# EAGLE schematic display (EAGLE 9.5.2)
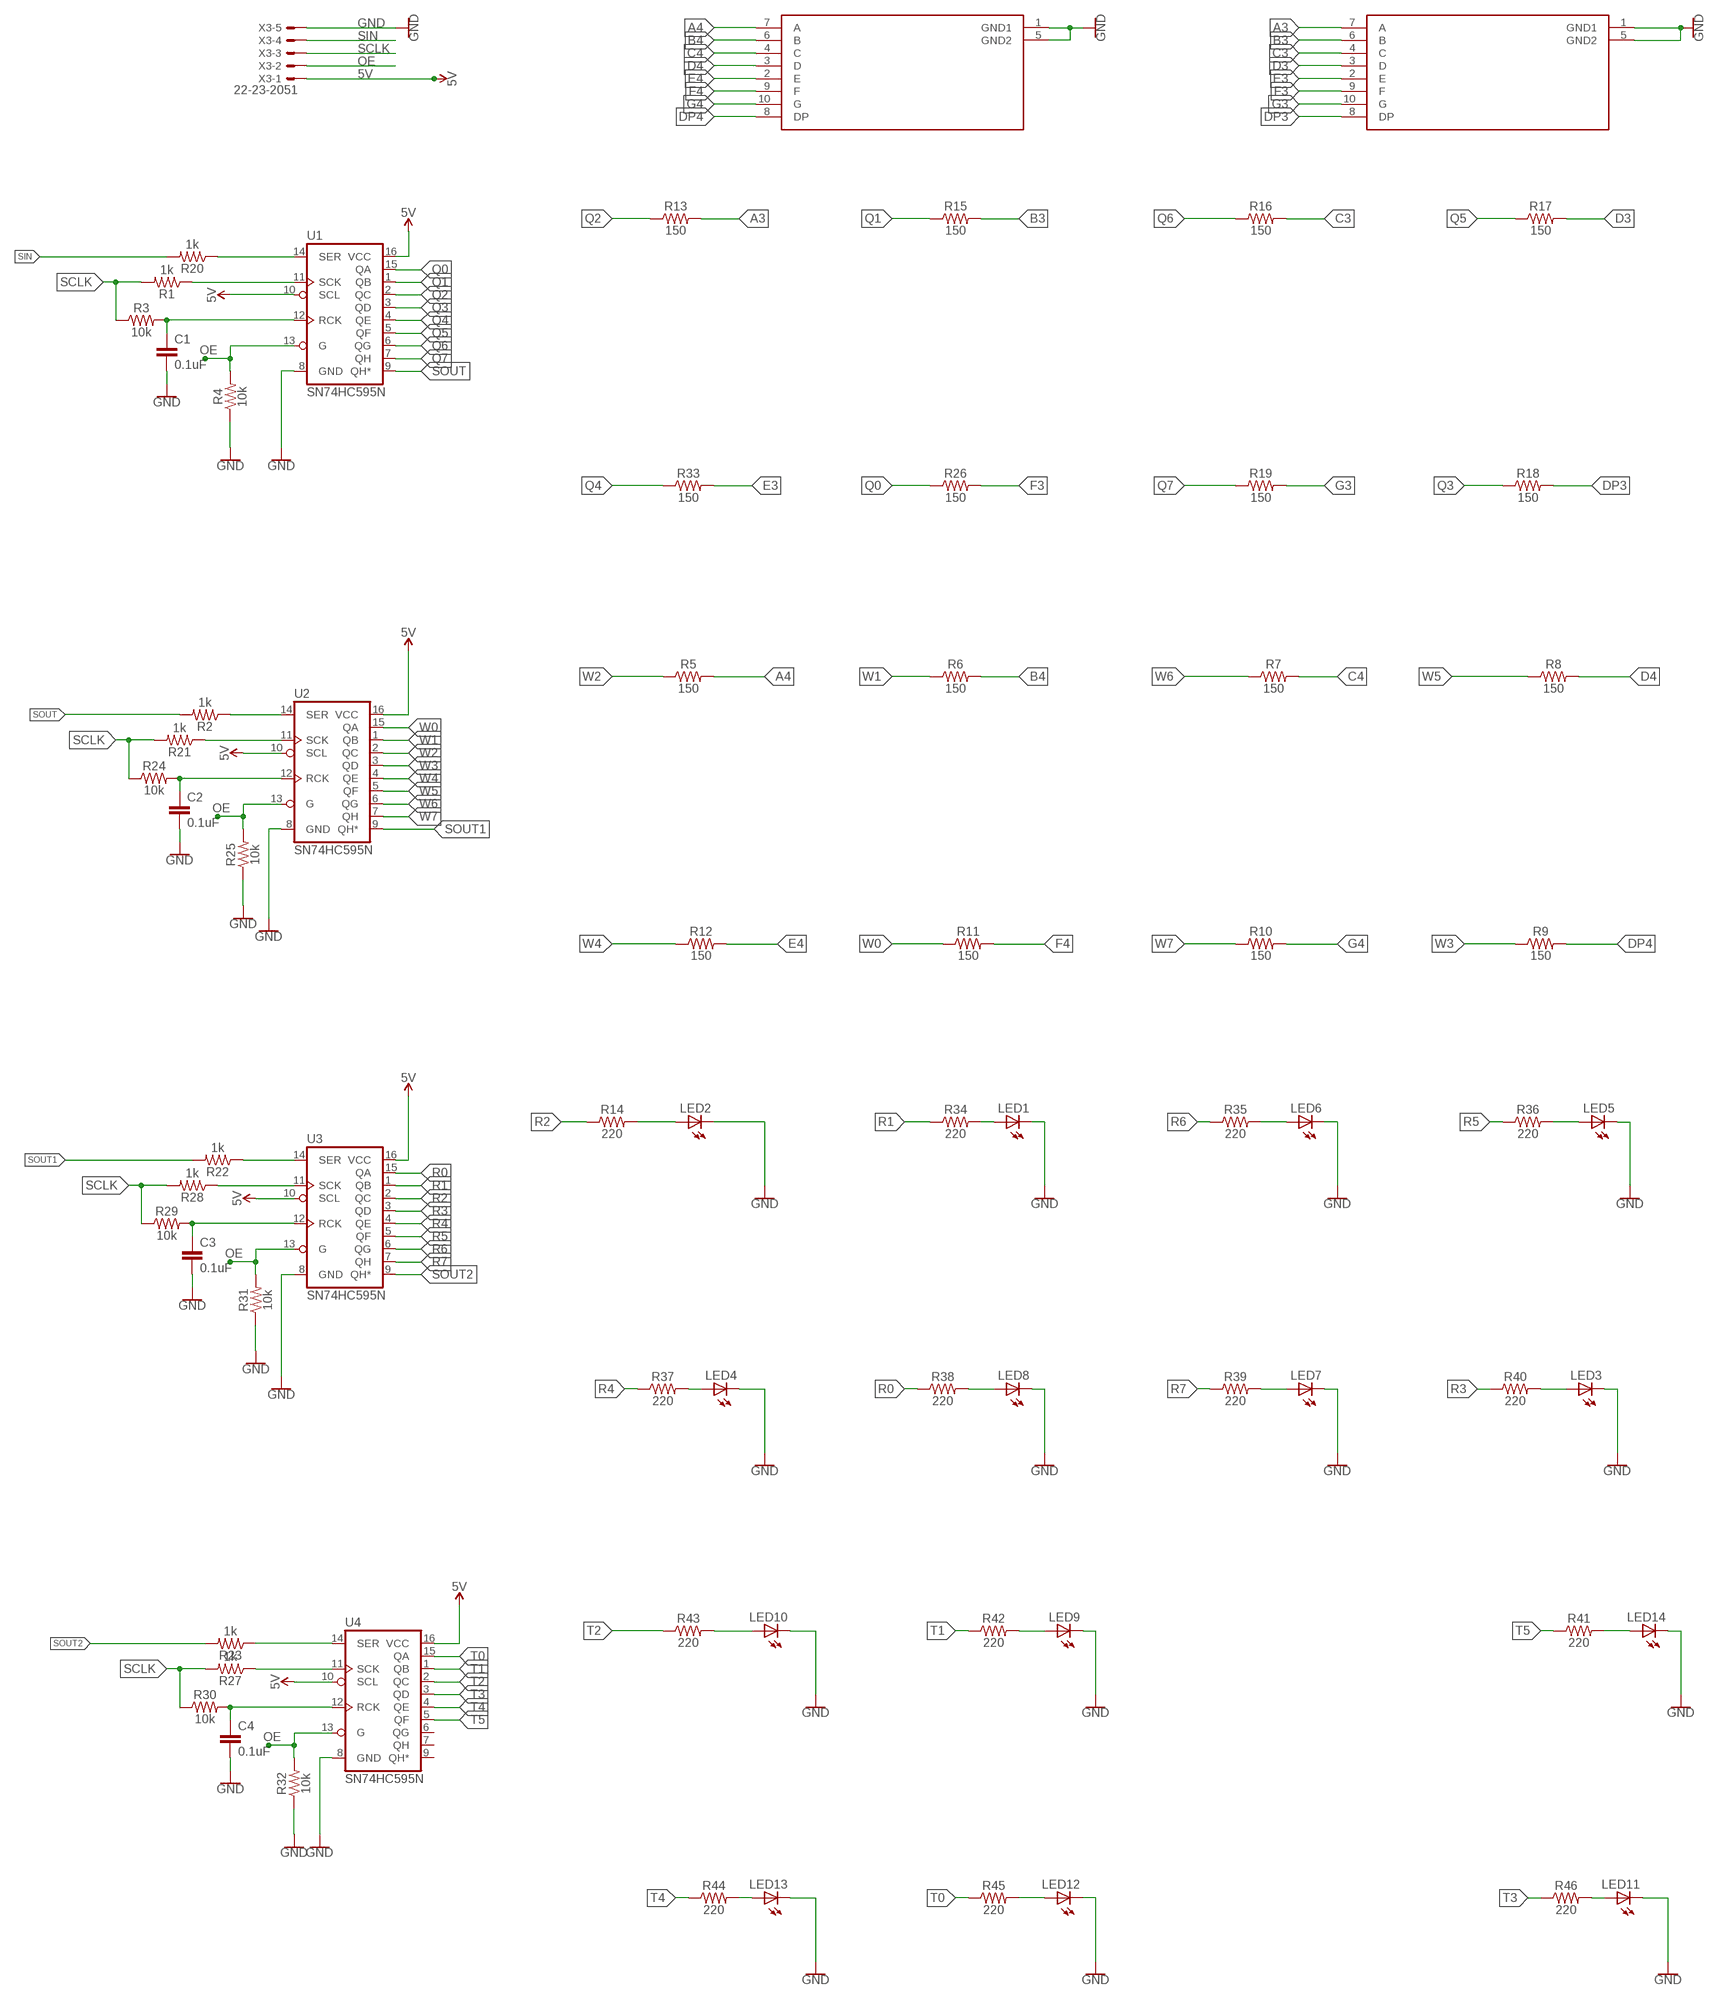
[diagram p0: schematic, sheet 1]

## Parts
C1  0.1uF  22PF-PTH-2.54MM-200V-5%  [CAP-PTH-2.54]
C2  0.1uF  22PF-PTH-2.54MM-200V-5%  [CAP-PTH-2.54]
C3  0.1uF  22PF-PTH-2.54MM-200V-5%  [CAP-PTH-2.54]
C4  0.1uF  22PF-PTH-2.54MM-200V-5%  [CAP-PTH-2.54]
LED1  LED5MM  [LED5MM]
LED2  LED5MM  [LED5MM]
LED3  LED5MM  [LED5MM]
LED4  LED5MM  [LED5MM]
LED5  LED5MM  [LED5MM]
LED6  LED5MM  [LED5MM]
LED7  LED5MM  [LED5MM]
LED8  LED5MM  [LED5MM]
LED9  LED5MM  [LED5MM]
LED10  LED5MM  [LED5MM]
LED11  LED5MM  [LED5MM]
LED12  LED5MM  [LED5MM]
LED13  LED5MM  [LED5MM]
LED14  LED5MM  [LED5MM]
R1  1k  1KOHM-HORIZ-1/4W-5%  [AXIAL-0.3]
R2  1k  1KOHM-HORIZ-1/4W-5%  [AXIAL-0.3]
R3  10k  10KOHM-HORIZ-1/4W-5%  [AXIAL-0.3]
R4  10k  10KOHM-HORIZ-1/4W-5%  [AXIAL-0.3]
R5  150  10KOHM-HORIZ-1/4W-5%  [AXIAL-0.3]
R6  150  10KOHM-HORIZ-1/4W-5%  [AXIAL-0.3]
R7  150  10KOHM-HORIZ-1/4W-5%  [AXIAL-0.3]
R8  150  10KOHM-HORIZ-1/4W-5%  [AXIAL-0.3]
R9  150  10KOHM-HORIZ-1/4W-5%  [AXIAL-0.3]
R10  150  10KOHM-HORIZ-1/4W-5%  [AXIAL-0.3]
R11  150  10KOHM-HORIZ-1/4W-5%  [AXIAL-0.3]
R12  150  10KOHM-HORIZ-1/4W-5%  [AXIAL-0.3]
R13  150  10KOHM-HORIZ-1/4W-5%  [AXIAL-0.3]
R14  220  10KOHM-HORIZ-1/4W-5%  [AXIAL-0.3]
R15  150  10KOHM-HORIZ-1/4W-5%  [AXIAL-0.3]
R16  150  10KOHM-HORIZ-1/4W-5%  [AXIAL-0.3]
R17  150  10KOHM-HORIZ-1/4W-5%  [AXIAL-0.3]
R18  150  10KOHM-HORIZ-1/4W-5%  [AXIAL-0.3]
R19  150  10KOHM-HORIZ-1/4W-5%  [AXIAL-0.3]
R20  1k  1KOHM-HORIZ-1/4W-5%  [AXIAL-0.3]
R21  1k  1KOHM-HORIZ-1/4W-5%  [AXIAL-0.3]
R22  1k  1KOHM-HORIZ-1/4W-5%  [AXIAL-0.3]
R23  1k  1KOHM-HORIZ-1/4W-5%  [AXIAL-0.3]
R24  10k  10KOHM-HORIZ-1/4W-5%  [AXIAL-0.3]
R25  10k  10KOHM-HORIZ-1/4W-5%  [AXIAL-0.3]
R26  150  10KOHM-HORIZ-1/4W-5%  [AXIAL-0.3]
R27  1k  1KOHM-HORIZ-1/4W-5%  [AXIAL-0.3]
R28  1k  1KOHM-HORIZ-1/4W-5%  [AXIAL-0.3]
R29  10k  10KOHM-HORIZ-1/4W-5%  [AXIAL-0.3]
R30  10k  10KOHM-HORIZ-1/4W-5%  [AXIAL-0.3]
R31  10k  10KOHM-HORIZ-1/4W-5%  [AXIAL-0.3]
R32  10k  10KOHM-HORIZ-1/4W-5%  [AXIAL-0.3]
R33  150  10KOHM-HORIZ-1/4W-5%  [AXIAL-0.3]
R34  220  10KOHM-HORIZ-1/4W-5%  [AXIAL-0.3]
R35  220  10KOHM-HORIZ-1/4W-5%  [AXIAL-0.3]
R36  220  10KOHM-HORIZ-1/4W-5%  [AXIAL-0.3]
R37  220  10KOHM-HORIZ-1/4W-5%  [AXIAL-0.3]
R38  220  10KOHM-HORIZ-1/4W-5%  [AXIAL-0.3]
R39  220  10KOHM-HORIZ-1/4W-5%  [AXIAL-0.3]
R40  220  10KOHM-HORIZ-1/4W-5%  [AXIAL-0.3]
R41  220  10KOHM-HORIZ-1/4W-5%  [AXIAL-0.3]
R42  220  10KOHM-HORIZ-1/4W-5%  [AXIAL-0.3]
R43  220  10KOHM-HORIZ-1/4W-5%  [AXIAL-0.3]
R44  220  10KOHM-HORIZ-1/4W-5%  [AXIAL-0.3]
R45  220  10KOHM-HORIZ-1/4W-5%  [AXIAL-0.3]
R46  220  10KOHM-HORIZ-1/4W-5%  [AXIAL-0.3]
U1  SN74HC595N  74HC595N  [DIP16]
U2  SN74HC595N  74HC595N  [DIP16]
U3  SN74HC595N  74HC595N  [DIP16]
U4  SN74HC595N  74HC595N  [DIP16]
U$1  DISPLAY1.2  [1.2INCH]
U$2  DISPLAY1.2  [1.2INCH]
X3  22-23-2051  [22-23-2051]

## Nets
5V [5v]: U1.10(SCL) U1.16(VCC) U2.10(SCL) U2.16(VCC) U3.10(SCL) U3.16(VCC) U4.10(SCL) U4.16(VCC) X3.1
A3: R13.P$2 U$1.7(A)
A4: R5.P$2 U$2.7(A)
B3: R15.P$2 U$1.6(B)
B4: R6.P$2 U$2.6(B)
C3: R16.P$2 U$1.4(C)
C4: R7.P$2 U$2.4(C)
D3: R17.P$2 U$1.3(D)
D4: R8.P$2 U$2.3(D)
DP3: R18.P$2 U$1.8(DP)
DP4: R9.P$2 U$2.8(DP)
E3: R33.P$2 U$1.2(E)
E4: R12.P$2 U$2.2(E)
F3: R26.P$2 U$1.9(F)
F4: R11.P$2 U$2.9(F)
G3: R19.P$2 U$1.10(G)
G4: R10.P$2 U$2.10(G)
GND: C1.2 C2.2 C3.2 C4.2 LED1.K(C) LED2.K(C) LED3.K(C) LED4.K(C) LED5.K(C) LED6.K(C) LED7.K(C) LED8.K(C) LED9.K(C) LED10.K(C) LED11.K(C) LED12.K(C) LED13.K(C) LED14.K(C) R4.P$1 R25.P$1 R31.P$1 R32.P$1 U1.8(GND) U2.8(GND) U3.8(GND) U4.8(GND) U$1.1(GND1) U$1.5(GND2) U$2.1(GND1) U$2.5(GND2) X3.5
N$1: R20.P$1 U1.14(SER)
N$2: R1.P$1 U1.11(SCK)
N$5: C1.1 R3.P$2 U1.12(RCK)
N$6: R2.P$1 U2.14(SER)
N$10: R21.P$1 U2.11(SCK)
N$18: C2.1 R24.P$2 U2.12(RCK)
N$32: LED4.A R37.P$2
N$33: LED8.A R38.P$2
N$34: LED7.A R39.P$2
N$35: LED3.A R40.P$2
N$36: LED5.A R36.P$2
N$37: LED6.A R35.P$2
N$38: LED1.A R34.P$2
N$39: LED2.A R14.P$2
N$40: LED10.A R43.P$2
N$41: R22.P$1 U3.14(SER)
N$42: R28.P$1 U3.11(SCK)
N$43: C3.1 R29.P$2 U3.12(RCK)
N$44: LED9.A R42.P$2
N$45: LED11.A R46.P$2
N$46: LED14.A R41.P$2
N$47: LED12.A R45.P$2
N$52: R23.P$1 U4.14(SER)
N$53: R27.P$1 U4.11(SCK)
N$54: C4.1 R30.P$2 U4.12(RCK)
N$58: LED13.A R44.P$2
OE [5v]: R4.P$2 R25.P$2 R31.P$2 R32.P$2 U1.13(G) U2.13(G) U3.13(G) U4.13(G) X3.2
Q0: R26.P$1 U1.15(QA)
Q1: R15.P$1 U1.1(QB)
Q2: R13.P$1 U1.2(QC)
Q3: R18.P$1 U1.3(QD)
Q4: R33.P$1 U1.4(QE)
Q5: R17.P$1 U1.5(QF)
Q6: R16.P$1 U1.6(QG)
Q7: R19.P$1 U1.7(QH)
R0: R38.P$1 U3.15(QA)
R1: R34.P$1 U3.1(QB)
R2: R14.P$1 U3.2(QC)
R3: R40.P$1 U3.3(QD)
R4: R37.P$1 U3.4(QE)
R5: R36.P$1 U3.5(QF)
R6: R35.P$1 U3.6(QG)
R7: R39.P$1 U3.7(QH)
SCLK [5v]: R1.P$2 R3.P$1 R21.P$2 R24.P$1 R27.P$2 R28.P$2 R29.P$1 R30.P$1 X3.3
SIN [5v]: R20.P$2 X3.4
SOUT: R2.P$2 U1.9(QH*)
SOUT1: R22.P$2 U2.9(QH*)
SOUT2: R23.P$2 U3.9(QH*)
T0: R45.P$1 U4.15(QA)
T1: R42.P$1 U4.1(QB)
T2: R43.P$1 U4.2(QC)
T3: R46.P$1 U4.3(QD)
T4: R44.P$1 U4.4(QE)
T5: R41.P$1 U4.5(QF)
W0: R11.P$1 U2.15(QA)
W1: R6.P$1 U2.1(QB)
W2: R5.P$1 U2.2(QC)
W3: R9.P$1 U2.3(QD)
W4: R12.P$1 U2.4(QE)
W5: R8.P$1 U2.5(QF)
W6: R7.P$1 U2.6(QG)
W7: R10.P$1 U2.7(QH)
Unconnected: U4.6(QG) U4.7(QH) U4.9(QH*)

## Library data of the parts
C1-C4 = SparkFun-Capacitors:22PF: 22pF ceramic capacitors A capacitor is a passive two-terminal electrical component used to store electrical energy temporarily in an electric field.; PROD_ID: CAP-09128; VALUE: 22pF
LED1-LED14 = adafruit:LED: LED OSRAM: - CHIPLED LG R971, LG N971, LY N971, LG Q971, LY Q971, LO R971, LY R971 LH N974, LH R974 LS Q976, LO Q976, LY Q976 LO Q996 - Hyper CHIPLED LW Q18S LB Q993, LB Q99A, LB R99A - SideLED LS A670, LO A670, LY A670, LG A670, LP A670 LB A673, LV A673, LT A673, LW A673 LH A674 LY A675 LS A676, LA A676, LO A676, LY A676, LW A676 LS A679, LY A679, LG A679 - Hyper Micro SIDELED® LS Y876, LA Y876, LO Y876, LY Y876 LT Y87S - SmartLED LW L88C, LW L88S LB L89C, LB L89S, LG L890 LS L89K, LO L89K, LY L89K LS L896, LA L896, LO L896, LY L896 - TOPLED LS T670, LO T670, LY T670, LG T670, LP T670 LSG T670, LSP T670, LSY T670, LOP T670, LYG T670 LG T671, LOG T671, LSG T671 LB T673, LV T673, LT T673, LW T673 LH T674 LS T676, LA T676, LO T676, LY T676, LB T676, LH T676, LSB T676, LW T676 LB T67C, LV T67C, LT T67C, LS T67K, LO T67K, LY T67K, LW E67C LS E67B, LA E67B, LO E67B, LY E67B, LB E67C, LV E67C, LT E67C LW T67C LS T679, LY T679, LG T679 LS T770, LO T770, LY T770, LG T770, LP T770 LB T773, LV T773, LT T773, LW T773 LH T774 LS E675, LA E675, LY E675, LS T675 LS T776, LA T776, LO T776, LY T776, LB T776 LHGB T686 LT T68C, LB T68C - Hyper Mini TOPLED® LB M676 - Mini TOPLED Santana® LG M470 LS M47K, LO M47K, LY M47K Source: http://www.osram.convergy.de/
R1 R2 R20-R23 R27 R28 = SparkFun-Resistors:1KOHM: 1kΩ resistor A resistor is a passive two-terminal electrical component that implements electrical resistance as a circuit element. Resistors act to reduce current flow, and, at the same time, act to lower voltage levels within circuits. - Wikipedia; PROD_ID: RES-08380
R3 R4 R24 R25 R29-R32 = SparkFun-Resistors:10KOHM: 10kΩ resistor A resistor is a passive two-terminal electrical component that implements electrical resistance as a circuit element. Resistors act to reduce current flow, and, at the same time, act to lower voltage levels within circuits. - Wikipedia; PROD_ID: RES-09435
R5-R19 R26 R33-R46 = SparkFun-Resistors:10KOHM: 10kΩ resistor A resistor is a passive two-terminal electrical component that implements electrical resistance as a circuit element. Resistors act to reduce current flow, and, at the same time, act to lower voltage levels within circuits. - Wikipedia; PROD_ID: RES-09435; VALUE: 10k
U1-U4 = SparkFun-IC-Logic:74*595: 8-Bit Shift Register (Serial to Parallel) Datasheet <http://cdn.sparkfun.com/datasheets/BreakoutBoards/MM74HC595.pdf> SparkFun Products SparkFun Shift Register Breakout - 74HC595 <https://www.sparkfun.com/products/10680> (BOB-10680); PROD_ID: IC-13123
U$1 U$2 = displays-vigs:DISPLAY1.2
X3 = con-molex:22-23-2051: .100" (2.54mm) Center Header - 5 Pin; MF: MOLEX; MPN: 22-23-2051; OC_FARNELL: 1462952; OC_NEWARK: 38C9178

## Net classes
0 default: width 0.3 mm
1 5v: width 0.5 mm